# EAGLE design working (EAGLE 9.6.2)
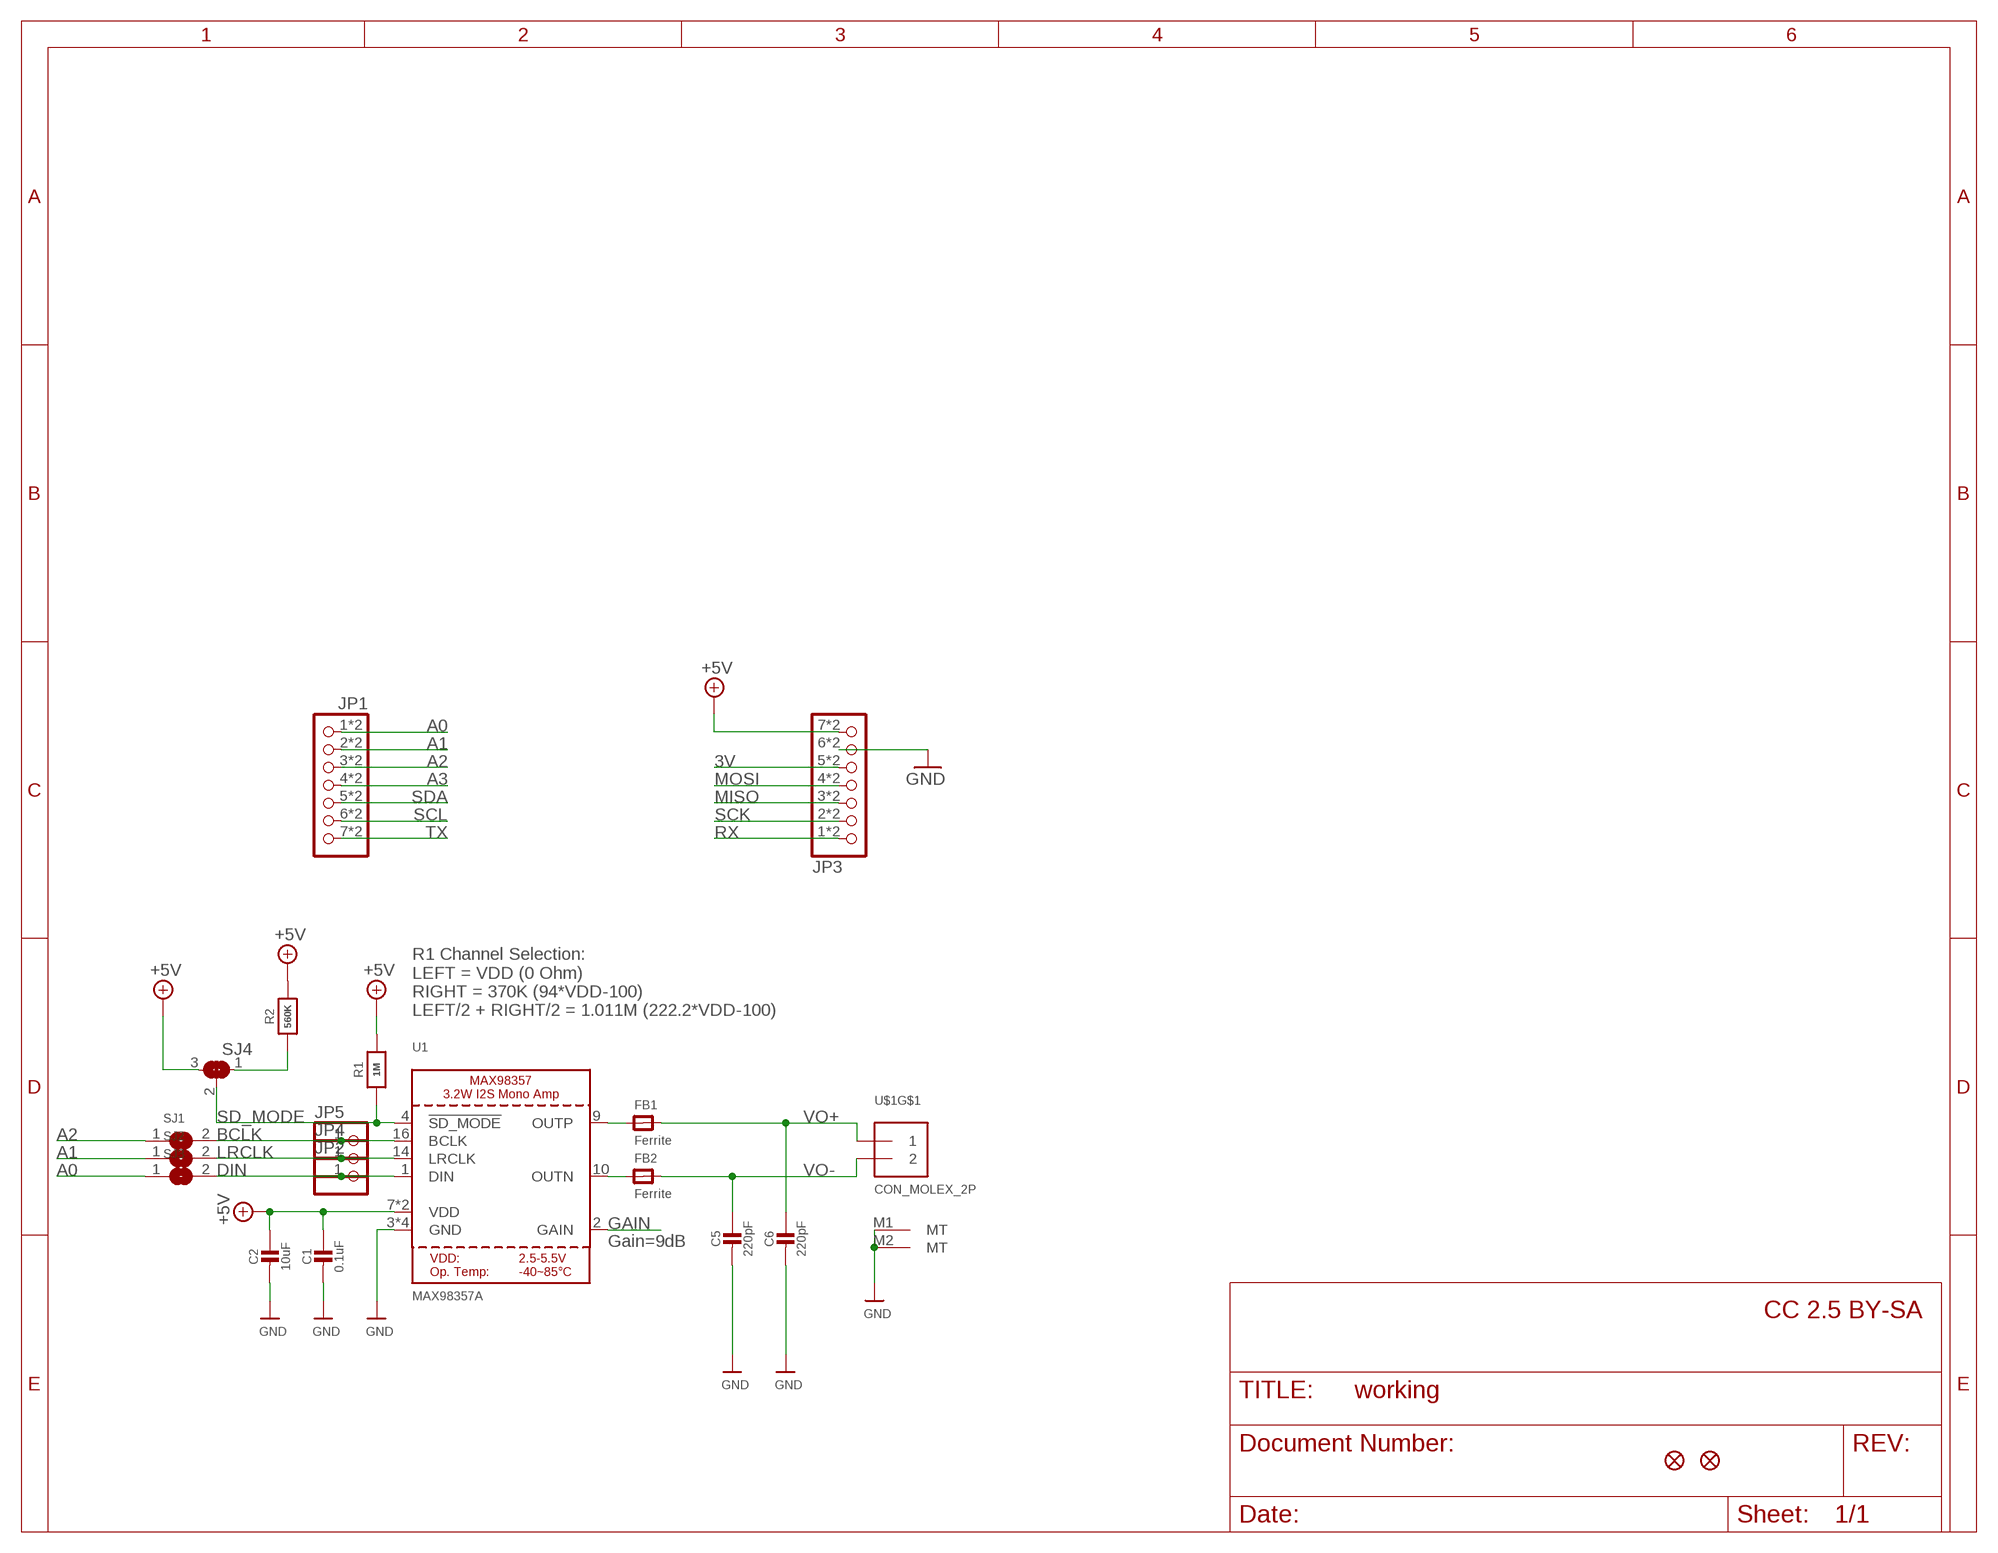
[diagram p0: schematic, sheet 1]

## Parts
C1  0.1uF  CAP_CERAMIC0603_NO  [0603-NO]
C2  10uF  CAP_CERAMIC0805-NOOUTLINE  [0805-NO]
C5  220pF  CAP_CERAMIC0603_NO  [0603-NO]
C6  220pF  CAP_CERAMIC0603_NO  [0603-NO]
FB1  Ferrite  FERRITE-0603NO  [0603-NO]
FB2  Ferrite  FERRITE-0603NO  [0603-NO]
JP1  HEADER-1X7_CASTEL  [1X07_CASTEL]
JP2  HEADER-1X12MM  [1X01_2MM]
JP3  HEADER-1X7_CASTEL  [1X07_CASTEL]
JP4  HEADER-1X12MM  [1X01_2MM]
JP5  HEADER-1X12MM  [1X01_2MM]
R1  1M  RESISTOR_0603_NOOUT  [0603-NO]
R2  560K  RESISTOR_0603_NOOUT  [0603-NO]
SJ1  SOLDERJUMPERCLOSED  [SOLDERJUMPER_CLOSEDWIRE]
SJ2  SOLDERJUMPERCLOSED  [SOLDERJUMPER_CLOSEDWIRE]
SJ3  SOLDERJUMPERCLOSED  [SOLDERJUMPER_CLOSEDWIRE]
SJ4  SOLDERJUMPER_2WAY  [SOLDERJUMPER_2WAY_OPEN_NOPASTE]
U1  MAX98357A  AUDIOAMP_MAX98357  [QFN16_3MM]
U$1  CON_MOLEX_2P  [53398-0271]
U$6  FIDUCIAL_1MM  [FIDUCIAL_1MM]
U$8  FIDUCIAL_1MM  [FIDUCIAL_1MM]

## Nets
3V: JP3.5 JP3.5C
+5V [power]: C1.1 C2.1 JP3.7 JP3.7C R1.2 R2.2 SJ4.3 U1.7(VDD) U1.8(VDD)
A0: JP1.1 JP1.1C SJ3.1
A1: JP1.2 JP1.2C SJ2.1
A2: JP1.3 JP1.3C SJ1.1
A3: JP1.4 JP1.4C
BCLK: JP5.1 SJ1.2 U1.16(BCLK)
DIN: JP2.1 SJ3.2 U1.1(DIN)
GAIN: U1.2(GAIN)
GND [power]: C1.2 C2.2 C5.2 C6.2 JP3.6 JP3.6C U1.3(GND) U1.11(GND) U1.15(GND) U1.THERMAL(GND) U$1.M1(MT) U$1.M2(MT)
LRCLK: JP4.1 SJ2.2 U1.14(LRCLK)
MISO: JP3.3 JP3.3C
MOSI: JP3.4 JP3.4C
N$1: R2.1 SJ4.1
N$5: FB2.1 U1.10(OUTN)
N$6: FB1.1 U1.9(OUTP)
RX: JP3.1 JP3.1C
SCK: JP3.2 JP3.2C
SCL: JP1.6 JP1.6C
SD_MODE: R1.1 SJ4.2 U1.4(!SD_MODE)
SDA: JP1.5 JP1.5C
TX: JP1.7 JP1.7C
VO+: C6.1 FB1.2 U$1.1
VO-: C5.1 FB2.2 U$1.2

## Notes on the sheet
- R1 Channel Selection:
  LEFT = VDD (0 Ohm)
  RIGHT = 370K (94*VDD-100)
  LEFT/2 + RIGHT/2 = 1.011M (222.2*VDD-100)
- Gain=9dB
- CC 2.5 BY-SA

## Library data of the parts
C1 C2 C5 C6 = microbuilder:CAP_CERAMIC: Ceramic Capacitors For new designs, use the packages preceded by an '_' character since they are more reliable: The following footprints should be used on most boards: _0402 - Standard footprint for regular board layouts _0603 - Standard footprint for regular board layouts _0805 - Standard footprint for regular board layouts _1206 - Standard footprint for regular board layouts For extremely tight-pitch boards where space is at a premium, the following 'micro-pitch' footprints can be used (smaller pads, no silkscreen outline, etc.): _0402MP - Micro-pitch footprint for very dense/compact boards _0603MP - Micro-pitch footprint for very dense/compact boards _0805MP - Micro-pitch footprint for very dense/compact boards _1206MP - Micro-pitch footprint for very dense/compact boards
FB1 FB2 = microbuilder:FERRITE: Ferrite Bead 0603 MMZ1608B121C - 120 Ohm @ 100MHz, 600mA, 0.15 Ohm DC Resistance - Digikey: 445-2164-1-ND BK1608HW121-T - 120 Ohm, 600mA Ferrite Chip - Digikey: 587-1876-2-ND 0805 HZ0805B272R-10 - 2.7K Ohm @ 100MHz, 200mA, 0.8 Ohm DC Resistance - Digikey: 240-2504-1-ND (see also Murata BLM21BD272SN1L) MMZ2012Y152B - 1.5K Ohm @ 100MHz, 500mA, 0.4 Ohm DC Resistance - Digikey: 445-1560-1-ND - Mainly for high frequency (80-400MHz) MMZ2012R102A - 1K Ohm @ 100MHz, 500mA, 0.3 Ohm DC Resistance - Digikey: 445-1555-2-ND - More general purpose (10-200MHz)
JP1 JP3 = adafruit_electromech:HEADER-1X7: PIN HEADER
JP2 JP4 JP5 = microbuilder:HEADER-1X1: PIN HEADER
R1 R2 = microbuilder:RESISTOR: Resistors For new designs, use the packages preceded by an '_' character since they are more reliable: The following footprints should be used on most boards: _0402 - Standard footprint for regular board layouts _0603 - Standard footprint for regular board layouts _0805 - Standard footprint for regular board layouts _1206 - Standard footprint for regular board layouts For extremely tight-pitch boards where space is at a premium, the following 'micro-pitch' footprints can be used (smaller pads, no silkscreen outline, etc.): _0402MP - Micro-pitch footprint for very dense/compact boards _0603MP - Micro-pitch footprint for very dense/compact boards _0805MP - Micro-pitch footprint for very dense/compact boards _1206MP - Micro-pitch footprint for very dense/compact boards
SJ1-SJ3 = microbuilder:SOLDERJUMPER: SMD Solder JUMPER Solder the two pads together to create a connection, or remove the solder to break it. REFLOW - Use this footprint for solder paste and reflow ovens. WAVE - Use this footprint for hand-soldering (larger pads). CLOSED - Has a trace between the two pads to ensure it is closed by default. The trace needs to be cut to disable the jumper, and can be closed again by creating a solder bridge between the two pads.
SJ4 = microbuilder:SOLDERJUMPER_2WAY: 2-Way Solder Jumper
U1 = microbuilder:AUDIOAMP_MAX98357: MAX98357 - 3.2W I2S Mono Audio Amp; ROT: 270
U$1 = adafruit_electromech:CON_MOLEX_2P
U$6 U$8 = microbuilder:FIDUCIAL: Fiducial Alignment Points Various fiducial points for machine vision alignment.; BOM: EXCLUDE

## Net classes
1 power: width 0.305 mm
2 thickpower: width 0.406 mm

## Board
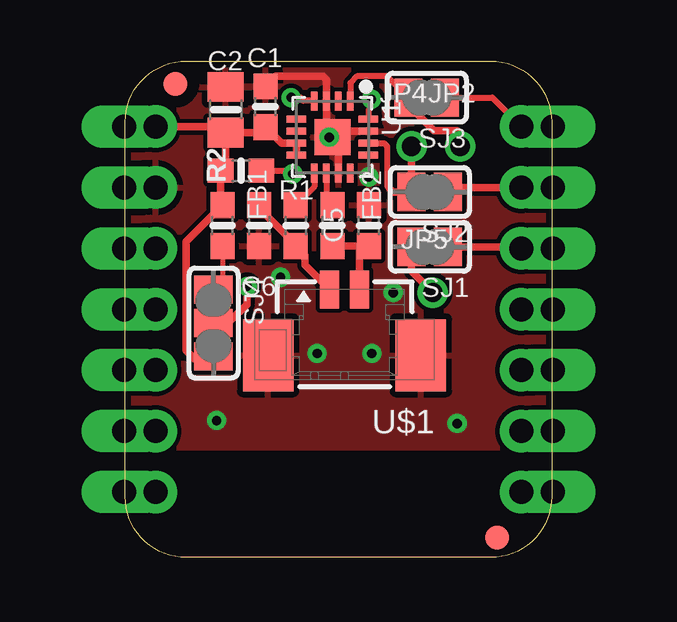
[diagram p1: board, top side]
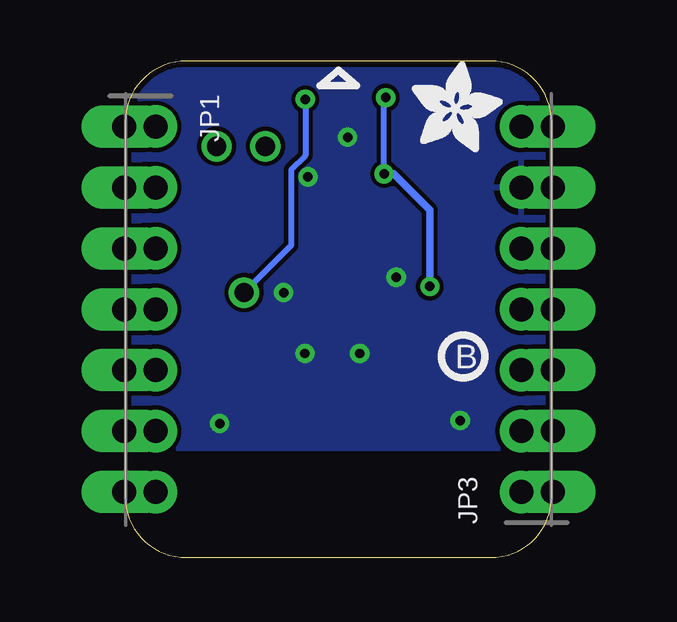
[diagram p2: board, bottom side, seen from below]

Size 17.78 x 20.7 mm. Coordinates in mm from the lower left corner, seen from the top.
Outline: 17.78,18.16 17.78,2.54 arc-90 15.24,0 2.54,0 arc-90 0,2.54 0,18.16 arc-90 2.54,20.7 15.24,20.7 arc-90 17.78,18.16
Copper layers (1*16): Top 0.035mm / dielectric 1.5mm / Bottom 0.035mm
Design rules "adafruit 7-7": minimum track width 7mil, minimum drill 15.5mil, track to track 7mil, track to pad 7mil, pad to pad 7mil, via to via 7mil, smd to smd 7mil, copper to edge 10mil, drill to drill 8mil, minimum pad ring 7mil, minimum via ring 8mil, stop-mask expansion 2mil, vias tented up to drill 20mil, thermal gap 10mil

### Footprints (pad centres in the part's own frame; a part is rotated, then mirrored left to right if it is on the bottom)
0603-NO = smd 1.075 x 1: 1 -0.85,0; 2 0.85,0
0805-NO = smd 1.24 x 1.5: 1 -0.95,0; 2 0.95,0
1X07_CASTEL = drill 1 pad 1.778: 1 -7.62,0; 2 -5.08,0; 3 -2.54,0; 4 0,0; 5 2.54,0; 6 5.08,0; 7 7.62,0 | drill 1 pad 1.778 long: 1C -7.62,-1.324; 2C -5.08,-1.324; 3C -2.54,-1.324; 4C 0,-1.324; 5C 2.54,-1.324; 6C 5.08,-1.324; 7C 7.62,-1.324
1X01_2MM = drill 0.8 pad 1.27: 1 0,0
SOLDERJUMPER_CLOSEDWIRE = smd 1.168 x 1.6: 1 -0.762,0; 2 0.762,0 | smd 0.635 x 0.203: WIRE 0,0
SOLDERJUMPER_2WAY_OPEN_NOPASTE = smd 1.168 x 1.6: 1 -1.397,0; 2 0,0; 3 1.397,0
QFN16_3MM = smd 0.8 x 0.28: 1 -1.5,0.75; 2 -1.5,0.25; 3 -1.5,-0.25; 4 -1.5,-0.75; 9 1.5,-0.75; 10 1.5,-0.25; 11 1.5,0.25; 12 1.5,0.75 | smd 0.28 x 0.8: 5 -0.75,-1.5; 6 -0.25,-1.5; 7 0.25,-1.5; 8 0.75,-1.5; 13 0.75,1.5; 14 0.25,1.5; 15 -0.25,1.5; 16 -0.75,1.5 | smd 1.5 x 1.5: THERMAL 0,0
53398-0271 = smd 0.8 x 1.6: 1 0.625,-1.27; 2 -0.625,-1.27 | smd 2.1 x 3: M1 3.185,1.48; M2 -3.185,1.48
FIDUCIAL_1MM = smd 1 x 1: 1 0,0

### Placement (x,y rotation side)
C1  5.84,18.8 90 top
C2  4.19,18.67 90 top
C5  10.16,13.84 90 top
C6  5.59,13.84 270 top
FB1  7.11,13.84 270 top
FB2  8.64,13.84 270 top
JP1  16.51,10.35 270 bottom
JP2  13.97,17.14 0 top
JP3  1.27,10.35 90 bottom
JP4  11.94,17.14 0 top
JP5  12.83,11.05 0 top
PLABEL1  [PLABEL1]  14.99,2.54 90 top
PLABEL2  [PLABEL2]  14.99,5.21 90 top
PLABEL3  [PLABEL3]  2.79,17.84 90 top
PLABEL4  [PLABEL4]  14.99,15.62 90 top
PLABEL5  [PLABEL5]  14.99,12.95 90 top
PLABEL6  [PLABEL6]  14.99,18.16 90 top
PLABEL7  [PLABEL7]  14.99,10.54 90 top
PLABEL8  [PLABEL8]  2.92,15.43 90 top
PLABEL12  [PLABEL12]  14.99,7.87 90 top
PLABEL14  [PLABEL14]  2.92,2.73 90 top
PLABEL19  [PLABEL19]  8.76,18.03 0 bottom
PLABEL20  [PLABEL20]  9.02,2.29 0 top
PLABEL21  [PLABEL21]  9.27,5.59 0 top
PLABEL22  [PLABEL22]  3.3,6.22 0 top
PLABEL23  [PLABEL23]  2.41,12.32 0 top
PLABEL24  [PLABEL24]  13.72,17.91 90 bottom
PLABEL25  [PLABEL25]  11.56,17.91 90 bottom
PLABEL26  [PLABEL26]  13.84,10.29 90 bottom
PLABEL27  [PLABEL27]  8.76,3.3 0 bottom
PLABEL28  [PLABEL28]  6.22,12.57 0 bottom
R1  4.83,16.13 180 top
R2  4.06,13.84 90 top
SJ1  12.7,12.95 180 top
SJ2  12.7,15.24 180 top
SJ3  12.57,19.18 180 top
SJ4  3.68,9.78 270 top
U1  8.64,17.53 270 top
U$1  9.14,9.91 180 top
U$2  [ADAFRUIT_3.5MM]  5.84,16.89 0 bottom
U$3  [PCBFEAT-REV-040]  3.68,8.38 0 bottom
U$6  15.51,0.83 0 top
U$8  2.1,19.75 0 top

### Tracks (layer width: path | path; a pad name or v marks a point on that pad's centre or on a via)
3V
  Top 0.305: JP3.5C JP3.5
+5V
  Top 0.305: JP3.7 JP3.7C 3.94,17.97 C2.1 | U1.8 U1.7 6.51,17.28 C1.1 5.62,17.72 C2.1 | C2.1 4.19,16.34 R1.2 3.98,14.78 R2.2 2.54,13.17 2.54,8.64 2.92,8.26 3.56,8.26 SJ4.3
A0
  Top 0.254: SJ3.1 15.3,19.18 JP1.1
  Top 0.305: JP1.1C JP1.1
A1
  Top 0.305: JP1.2C 17.02,15.43 JP1.2 13.65,15.43 SJ2.1
A2
  Top 0.254: JP1.3 16.48,12.92
  Top 0.305: JP1.3C JP1.3 | SJ1.1 15.75,12.95 15.88,12.83 16.38,12.83 16.48,12.92
A3
  Top 0.305: JP1.4C JP1.4
BCLK  (via drill 0.39)
  Top 0.254: U1.16 10.17,18.28 10.17,18.7 10.27,18.79 v10.27,19.11
  Top 0.305: SJ1.2 11.94,11.94 JP5.1
  Bottom 0.254: v10.27,19.11 10.27,16.76 10.87,16.17 10.87,13.01 JP5.1
DIN
  Top 0.254: SJ3.2 10.92,20.07 9.66,20.07 9.39,19.79 U1.1
  Top 0.305: SJ3.2 11.93,19.06 11.93,18.73 12.87,17.79 13.83,17.79 13.97,17.65 JP2.1
GND  (via drill 0.39)
  Top 0.305: U1.11 8.89,17.28 U1.THERMAL | U1.15 8.89,17.78 U1.THERMAL | U1.THERMAL 8.39,17.78 U1.3 8.39,19.93 8.26,20.07 6.26,20.07 C1.2
  other vias: 10.16,15.88 8.51,17.53 6.48,11.68 8,8.51 10.29,8.51 11.18,11.05 3.81,5.71 13.84,5.59
  pour Top: 0,20.7 17.78,20.7 17.78,4.57 0,4.57
  pour Bottom: 0,20.7 17.78,20.7 17.78,4.57 0,4.57
LRCLK
  Top 0.254: U1.14 10.79,17.28 10.92,17.14 10.92,15.49 11.05,15.37 | 11.81,15.37 SJ2.2
  Top 0.305: 11.05,15.37 11.18,15.24 SJ2.2 | JP4.1 11.94,15.49 11.81,15.37
MISO
  Top 0.305: JP3.3C JP3.3
MOSI
  Top 0.305: JP3.4C JP3.4
N$1
  Top 0.203: R2.1 4.06,11.56 SJ4.1
N$5
  Top 0.254: U1.10 8.39,14.94 FB2.1
N$6
  Top 0.254: U1.9 7.89,15.47 FB1.1
RX
  Top 0.305: JP3.1C JP3.1
SCK
  Top 0.305: JP3.2C JP3.2
SCL
  Top 0.305: JP1.6C JP1.6
SD_MODE  (via drill 0.39)
  Top 0.254: U1.4 7.86,19.05 7.43,19.05 7.3,19.18 v6.92,19.18 | v6.99,16 6.86,16.13 R1.1
  Top 0.305: SJ4.2 4.29,9.78 4.77,10.26 4.79,10.26 5.08,10.54 v5.08,11.3
  Bottom 0.254: v6.99,16 6.99,19.24 v6.92,19.18
  Bottom 0.305: v5.08,11.3 5.08,14.48 6.6,16 v6.99,16
SDA
  Top 0.305: JP1.5C JP1.5
TX
  Top 0.305: JP1.7C JP1.7
VO+
  Top 0.305: U$1.1 7.5,12.19 7.5,12.6 FB1.2 7.01,12.89 6.92,13.23 5.59,14.57 C6.1
VO-
  Top 0.305: C5.1 9.73,12.99 | 9.73,12.99 9.77,12.95 U$1.2 | FB2.2 9.73,12.99

### Text on the board
Pinguin_tBackup: 5V | A0 | A1 | G | 3V | S | A2 | R | - | A3 | MO | + | MI | SDA | L | 4-8Ω 3W | SCK | SCL | RX | Sig | TX | MAX98357A / I2S Amp BFF | NeoPixel BFF
Pinguin_bBackup: USB | LRC | DIN | NeoPixel Driver / Neo+ <-> 5V / QT Py. Solder / back to back / Signal on A3 | DIN=A0 / LR=A1 / BCLK=A2 | BIT | MAX98257A / I2S 3W Amp / Default Stereo